# EAGLE design mainboard (EAGLE 9.1.3)
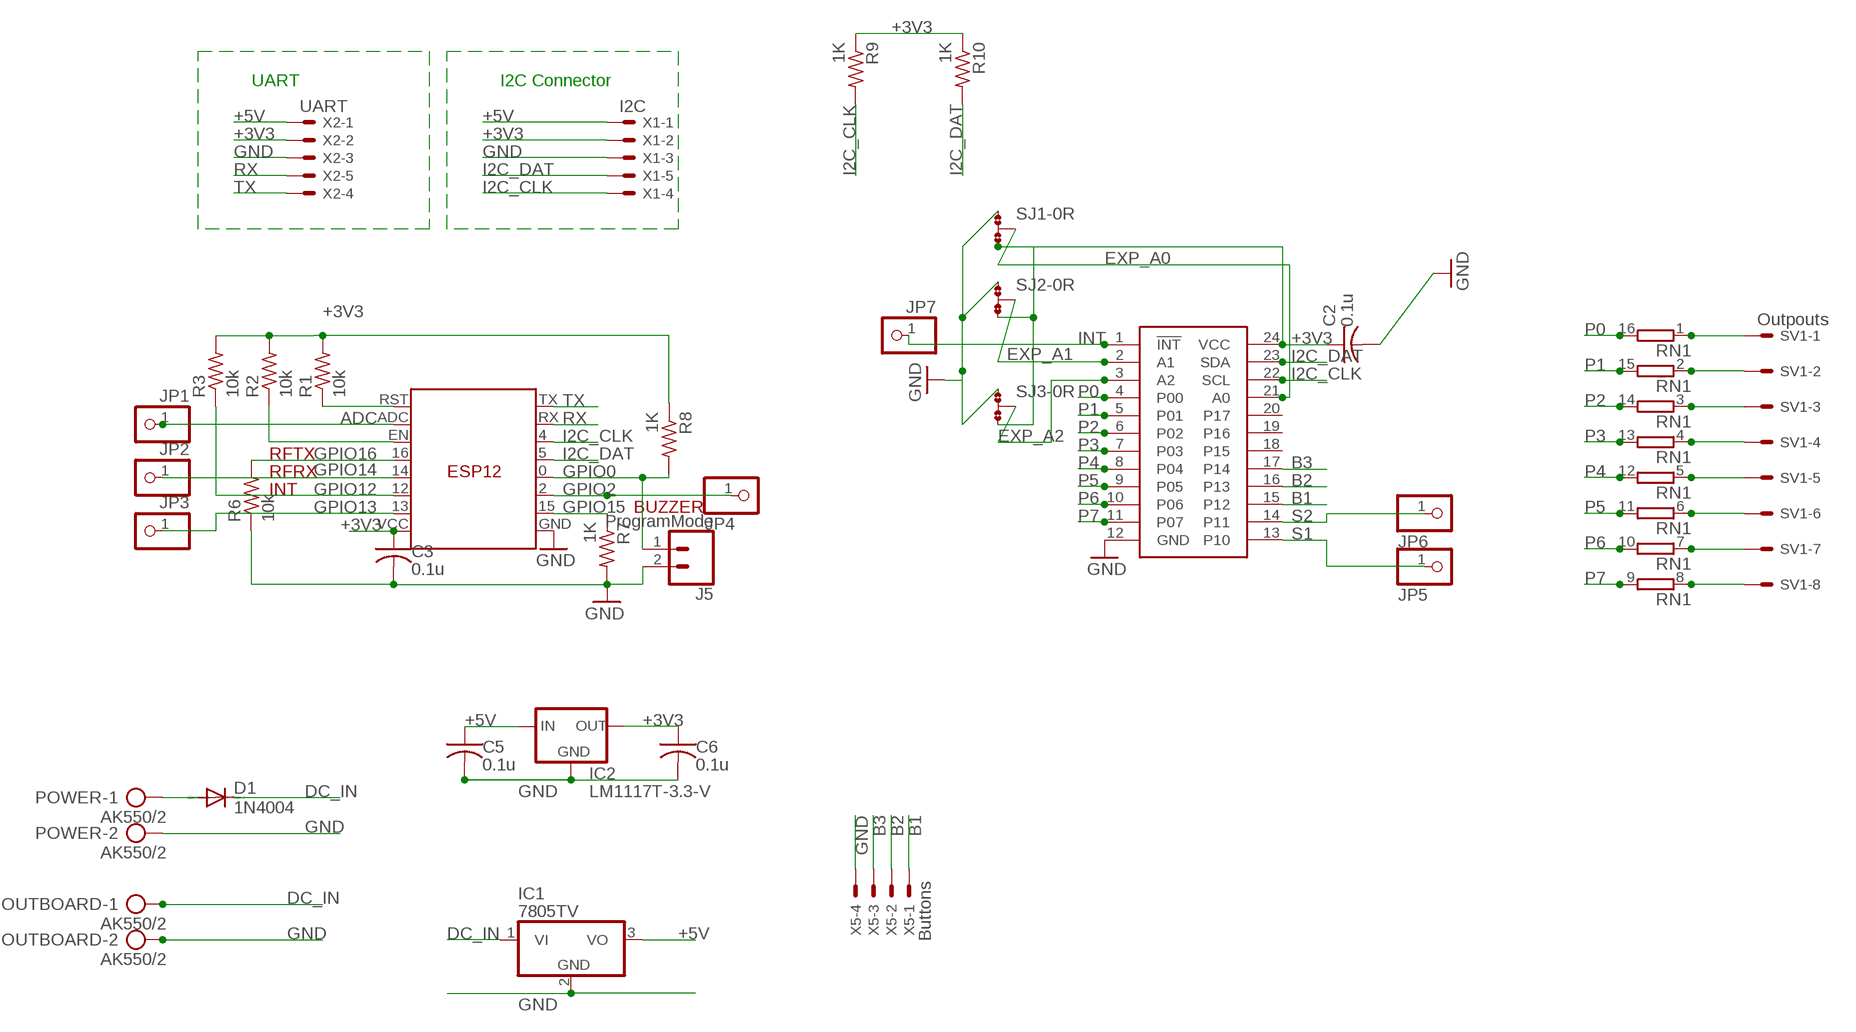
[diagram p0: schematic, sheet 1]

## Parts
C2  0.1u  C-US050-045X075  [C050-045X075]
C3  0.1u  C-US050-045X075  [C050-045X075]
C5  0.1u  C-US050-045X075  [C050-045X075]
C6  0.1u  C-US050-045X075  [C050-045X075]
D1  1N4004  [DO41-10]
ESP  ESP-12N  ESP12ESPWES  [ESP12_WES]
IC1  7805TV  [TO220V]
IC2  LM1117T-3.3-V  [TO220V]
J5  ProgramMode  CONN_02  [1X02]
JP1  PINHD-1X1  [1X01]
JP2  PINHD-1X1  [1X01]
JP3  PINHD-1X1  [1X01]
JP4  PINHD-1X1  [1X01]
JP5  PINHD-1X1  [1X01]
JP6  PINHD-1X1  [1X01]
JP7  PINHD-1X1  [1X01]
OUTBOARD  AK550/2  [AK550/2]
PCA9555  PCA9555  PCF8575TSSOP24  [TSSOP24]
POWER  AK550/2  [AK550/2]
R1  10k  R-US_0204/7  [0204/7]
R2  10k  R-US_0204/5  [0204/5]
R3  10k  R-US_0204/7  [0204/7]
R6  10k  R-US_0204/7  [0204/7]
R7  1K  R-US_0204/7  [0204/7]
R8  1K  R-US_0204/7  [0204/7]
R9  1K  R-US_0204/7  [0204/7]
R10  1K  R-US_0204/7  [0204/7]
RN1  8R-P  [DIL16]
SJ1  0R-JUMPA  [A0R-JMP]
SJ2  0R-JUMPA  [A0R-JMP]
SJ3  0R-JUMPA  [A0R-JMP]
SV1  Outpouts  22-23-2081  [22-23-2081]
X1  I2C  22-23-2051  [22-23-2051]
X2  UART  22-23-2051  [22-23-2051]
X5  Buttons  22-23-2041  [22-23-2041]

## Nets
+3V3 [power]: C2.1 C3.1 C6.1 ESP.VCC IC2.2(OUT) PCA9555.24(VCC) R1.2 R2.2 R3.2 R8.1 R9.1 R10.1 SJ1.3 SJ2.3 SJ3.3 X1.2 X2.2
+5V [power]: C5.1 IC1.3(VO) IC2.3(IN) X1.1 X2.1
ADC: ESP.ADC JP1.1
B1 [signal]: PCA9555.15(P12) X5.1
B2 [signal]: PCA9555.16(P13) X5.2
B3 [signal]: PCA9555.17(P14) X5.3
DC_IN [power]: D1.C IC1.1(VI) OUTBOARD.1
EXP_A0 [signal]: PCA9555.21(A0) SJ1.2
EXP_A1: PCA9555.2(A1) SJ2.2
EXP_A2: PCA9555.3(A2) SJ3.2
GND [power]: C2.2 C3.2 C5.2 C6.2 ESP.GND IC1.2(GND) IC2.1(GND) J5.2 OUTBOARD.2 PCA9555.12(GND) POWER.2 R6.1 R7.2 SJ1.1 SJ2.1 SJ3.1 X1.3 X2.3 X5.4
GPIO0: ESP.0(G0) J5.1 R8.2
GPIO2: ESP.2(G2) JP4.1
GPIO12: ESP.12(G12) R3.1
GPIO13: ESP.13(G13) JP3.1
GPIO14: ESP.14(G14) JP2.1
GPIO15: ESP.15(G15) R7.1
GPIO16: ESP.16(G16) R6.2
I2C_CLK: ESP.4(G4) PCA9555.22(SCL) R9.2 X1.4
I2C_DAT: ESP.5(G5) PCA9555.23(SDA) R10.2 X1.5
INT [signal]: JP7.1 PCA9555.1(!INT)
N$3 [power]: D1.A POWER.1
N$6: ESP.EN R2.1
N$7: RN1.1 SV1.1
N$8: RN1.2 SV1.2
N$9: RN1.3 SV1.3
N$10: RN1.4 SV1.4
N$12: RN1.5 SV1.5
N$13: RN1.6 SV1.6
N$14: RN1.7 SV1.7
N$16: RN1.8 SV1.8
N$19: ESP.RST R1.1
P0: PCA9555.4(P00) RN1.16
P1: PCA9555.5(P01) RN1.15
P2: PCA9555.6(P02) RN1.14
P3: PCA9555.7(P03) RN1.13
P4: PCA9555.8(P04) RN1.12
P5: PCA9555.9(P05) RN1.11
P6: PCA9555.10(P06) RN1.10
P7: PCA9555.11(P07) RN1.9
RX: ESP.RX X2.5
S1 [signal]: JP5.1 PCA9555.13(P10)
S2 [signal]: JP6.1 PCA9555.14(P11)
TX: ESP.TX X2.4
Unconnected: PCA9555.18(P15) PCA9555.19(P16) PCA9555.20(P17)

## Notes on the sheet
- UART | I2C Connector
- RFTX
- RFRX
- INT
- BUZZER

## Library data of the parts
C2 C3 C5 C6 = resistor:C-US: CAPACITOR, American symbol
D1 = diode:1N4004: DIODE general purpose rectifier, 1 A
ESP = JeeParts:ESP12
IC1 = linear:78*: Positive VOLTAGE REGULATOR Source: http://cache.national.com/ds/LM/LM78L05.pdf http://www.fairchildsemi.com/ds/LM/LM7805.pdf
IC2 = lm1117:LM1117T-*
J5 = SparkFun-Connectors:CONN_02: Multi connection point. Often used as Generic Header-pin footprint for 0.1 inch spaced/style header connections On any of the 0.1 inch spaced packages, you can populate with these: Break Away Headers - Straight <https://www.sparkfun.com/products/116> (PRT-00116) Break Away Male Headers - Right Angle <https://www.sparkfun.com/products/553> (PRT-00553) Female Headers <https://www.sparkfun.com/products/115> (PRT-00115) Break Away Headers - Machine Pin <https://www.sparkfun.com/products/117> (PRT-00117) Break Away Female Headers - Swiss Machine Pin <https://www.sparkfun.com/products/743> (PRT-00743) For SCREWTERMINALS and SPRING TERMINALS visit here: Screw Terimnals on SparkFun.com <https://www.sparkfun.com/search/results?term=Screw+Terminals> (5mm/3.5mm/2.54mm spacing) This device is also useful as a general connection point to wire up your design to another part of your project. Our various solder wires solder well into these plated through hole pads. Hook-Up Wire - Assortment (Stranded, 22 AWG) <https://www.sparkfun.com/products/11375> (PRT-11375) Hook-Up Wire - Assortment (Solid Core, 22 AWG) <https://www.sparkfun.com/products/11367> (PRT-11367) View the entire wire category on our website here <https://www.sparkfun.com/categories/141> Special notes: Molex polarized connector foot print use with: PRT-08233 with associated crimp pins and housings. 2.54_SCREWTERM for use with PRT-10571. 3.5mm Screw Terminal footprints for PRT-08084 5mm Screw Terminal footprints for use with PRT-08432
JP1-JP7 = pinhead:PINHD-1X1: PIN HEADER
OUTBOARD POWER = con-ptr500:AK550/2: CONNECTOR; OC_FARNELL: unknown; OC_NEWARK: unknown
PCA9555 = SparkFunNew:PCF8575
R1-R3 R6-R10 = resistor:R-US_: RESISTOR, American symbol
RN1 = resistor-dil:8R-P: DIL RESISTOR; OC_FARNELL: unknown; OC_NEWARK: unknown
SJ1-SJ3 = jump-0r-smd:0R-JUMP: SMD 0R 0805 Jumper
SV1 = con-molex:22-23-2081: .100" (2.54mm) Center Header - 8 Pin; MF: MOLEX; MPN: 22-23-2081; OC_FARNELL: 1756826; OC_NEWARK: 01C7592
X1 X2 = con-molex:22-23-2051: .100" (2.54mm) Center Header - 5 Pin; MF: MOLEX; MPN: 22-23-2051; OC_FARNELL: 1462952; OC_NEWARK: 38C9178
X5 = con-molex:22-23-2041: .100" (2.54mm) Center Header - 4 Pin; MF: MOLEX; MPN: 22-23-2041; OC_FARNELL: 1462920; OC_NEWARK: 38C0355

## Net classes
0 default: width 0.406 mm
1 power: width 0.406 mm, drill 0.508 mm, clearance 0.203 mm
3 signal: width 0.406 mm, clearance 0.178 mm
4 adc: width 0.406 mm, clearance 0.178 mm

## Board
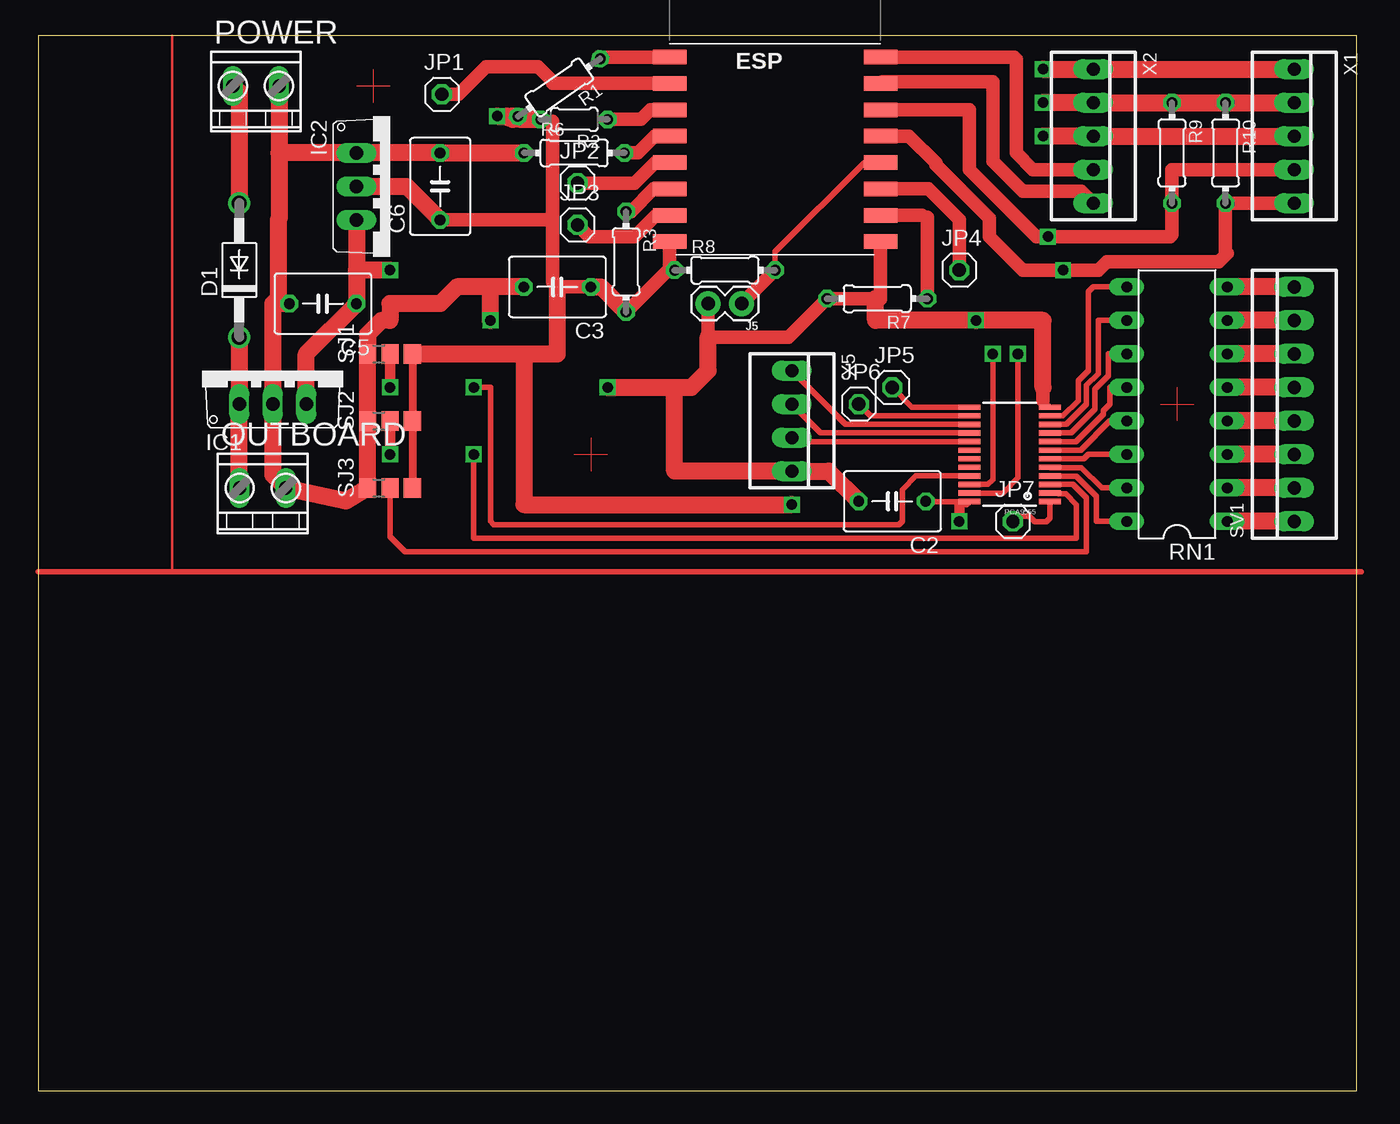
[diagram p1: board, top side]
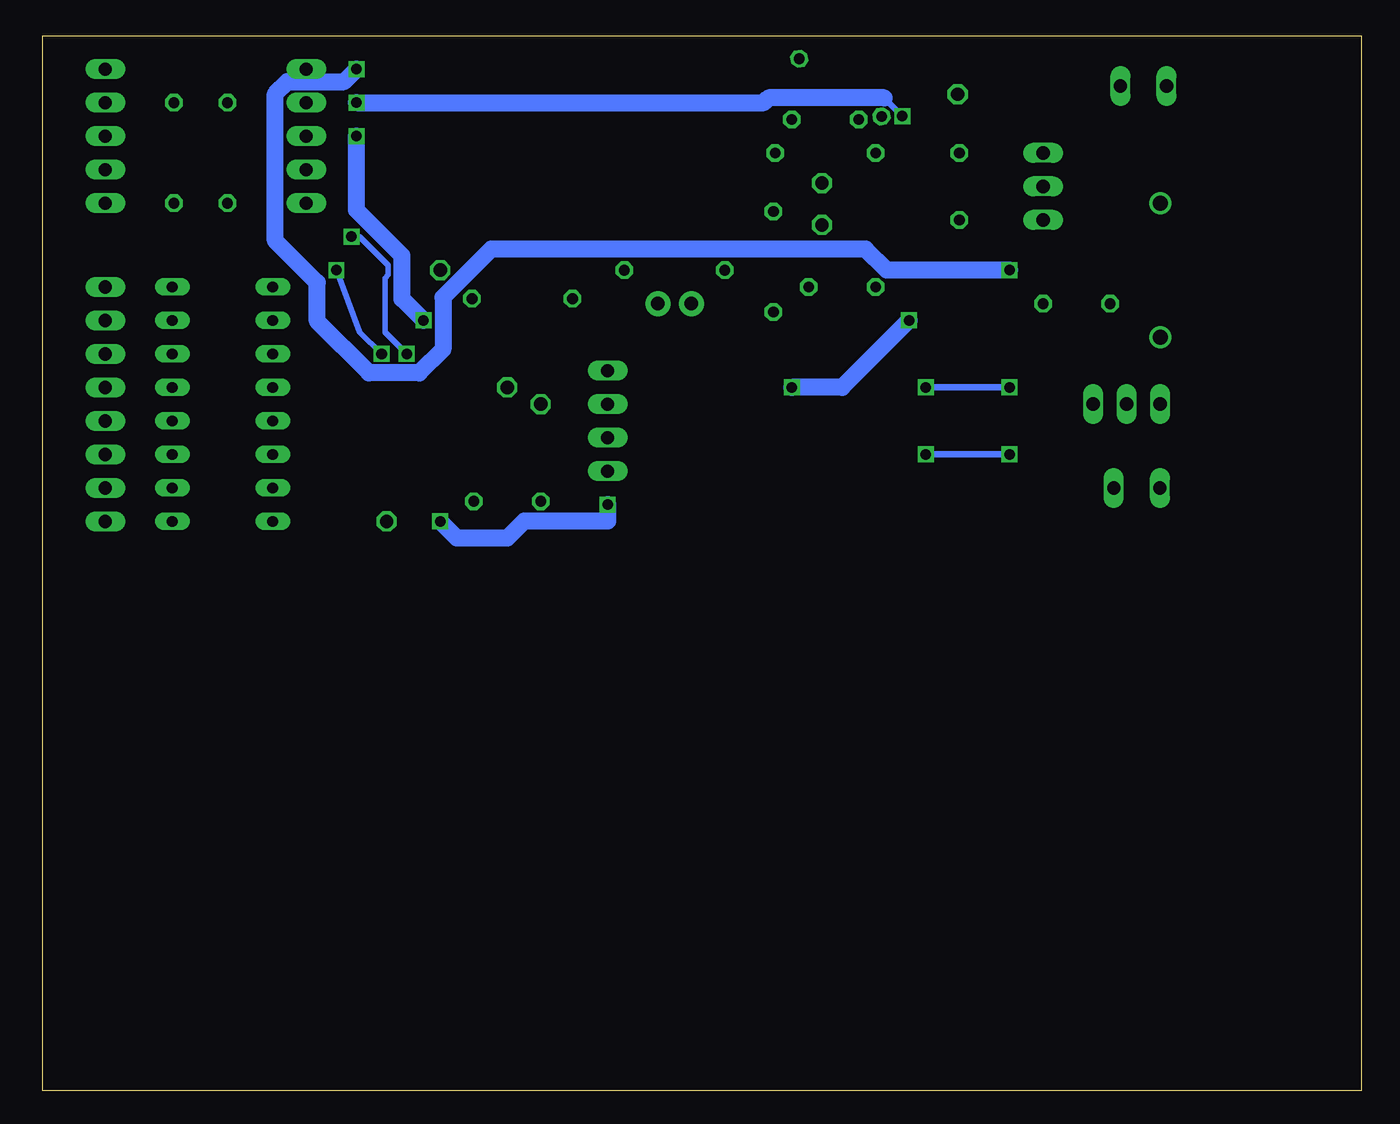
[diagram p2: board, bottom side, seen from below]

Size 100 x 80 mm. Coordinates in mm from the lower left corner, seen from the top.
Outline: 0,0 100,0 100,80 0,80 0,0
Copper layers (1*16): Top 0.035mm / dielectric 1.5mm / Bottom 0.035mm
Design rules "default": minimum track width 6mil, minimum drill 0.35mm, track to track 6mil, track to pad 6mil, pad to pad 6mil, via to via 6mil, smd to smd 6mil, copper to edge 40mil, drill to drill 6mil, minimum pad ring 10mil, minimum via ring 8mil, stop-mask expansion 4mil, vias tented up to drill 0mil, thermal gap 10mil

### Footprints (pad centres in the part's own frame; a part is rotated, then mirrored left to right if it is on the bottom)
C050-045X075 = drill 0.813 octagon: 1 -2.54,0; 2 2.54,0
DO41-10 = drill 1.118: A 5.08,0; C -5.08,0
ESP12_WES = smd 2.54 x 1.1: 0 8,-3.27; 2 8,-5.27; 4 8,0.73; 5 8,-1.27; 12 -8,-5.27; 13 -8,-7.27; 14 -8,-3.27; 15 8,-7.27; 16 -8,-1.27; ADC -8,2.73; EN -8,0.73; GND 8,-9.27; RST -8,4.73; RX 8,2.73; TX 8,4.73; VCC -8,-9.27
TO220V = drill 1.016 long: 1 -2.54,-2.54; 2 0,-2.54; 3 2.54,-2.54
1X02 = drill 1.016 pad 1.88: 1 0,0; 2 2.54,0
1X01 = drill 1.016 octagon: 1 0,0
AK550/2 = drill 1 pad 1.5 long: 1 -1.75,0; 2 1.75,0
TSSOP24 = smd 0.4 x 1.65: 1 -3.575,-3.05; 2 -2.925,-3.05; 3 -2.275,-3.05; 4 -1.625,-3.05; 5 -0.975,-3.05; 6 -0.325,-3.05; 7 0.325,-3.05; 8 0.975,-3.05; 9 1.625,-3.05; 10 2.275,-3.05; 11 2.925,-3.05; 12 3.575,-3.05; 13 3.575,3.05; 14 2.925,3.05; 15 2.275,3.05; 16 1.625,3.05; 17 0.975,3.05; 18 0.325,3.05; 19 -0.325,3.05; 20 -0.975,3.05; 21 -1.625,3.05; 22 -2.275,3.05; 23 -2.925,3.05; 24 -3.575,3.05
0204/7 = drill 0.813 octagon: 1 -3.81,0; 2 3.81,0
0204/5 = drill 0.813 octagon: 1 -2.54,0; 2 2.54,0
DIL16 = drill 0.813 long: 1 -8.89,-3.81; 2 -6.35,-3.81; 3 -3.81,-3.81; 4 -1.27,-3.81; 5 1.27,-3.81; 6 3.81,-3.81; 7 6.35,-3.81; 8 8.89,-3.81; 9 8.89,3.81; 10 6.35,3.81; 11 3.81,3.81; 12 1.27,3.81; 13 -1.27,3.81; 14 -3.81,3.81; 15 -6.35,3.81; 16 -8.89,3.81
A0R-JMP = smd 1.5 x 1.3: 1 0,1.7; 2 0,0; 3 0,-1.7
22-23-2081 = drill 1 long: 1 -8.89,0; 2 -6.35,0; 3 -3.81,0; 4 -1.27,0; 5 1.27,0; 6 3.81,0; 7 6.35,0; 8 8.89,0
22-23-2051 = drill 1 long: 1 -5.08,0; 2 -2.54,0; 3 0,0; 4 2.54,0; 5 5.08,0
22-23-2041 = drill 1 long: 1 -3.81,0; 2 -1.27,0; 3 1.27,0; 4 3.81,0

### Placement (x,y rotation side)
C2  64.77,44.7 180 top
C3  39.37,60.96 180 top
C5  21.59,59.69 180 top
C6  30.48,68.58 90 top
D1  15.24,62.23 90 top
ESP  55.88,73.66 0 top
IC1  17.78,54.61 0 top
IC2  26.67,68.58 270 top
J5  53.34,59.69 180 top
JP1  30.61,75.56 0 top
JP2  40.89,68.83 0 top
JP3  40.89,65.66 0 top
JP4  69.85,62.23 0 top
JP5  64.77,53.34 0 top
JP6  62.23,52.07 0 top
JP7  73.91,43.18 0 top
OUTBOARD  17.02,45.72 0 top
PCA9555  73.66,48.26 90 top
POWER  16.51,76.2 0 top
R1  39.5,76.07 215 top
R2  40.64,73.66 180 top
R3  44.58,62.87 270 top
R6  40.64,71.12 0 top
R7  63.63,60.07 180 top
R8  52.07,62.23 0 top
R9  85.98,71.12 270 top
R10  90.04,71.12 270 top
RN1  86.36,52.07 90 top
SJ1  26.67,55.88 90 top
SJ2  26.67,50.8 90 top
SJ3  26.67,45.72 90 top
SV1  95.25,52.07 90 top
X1  95.25,72.39 270 top
X2  80.01,72.39 270 top
X5  57.15,50.8 270 top

### Tracks (layer width: path | path; a pad name or v marks a point on that pad's centre or on a via)
+3V3  (via drill 0.8)
  Top 0.406: C2.1 67.33,44.69 PCA9555.24 70.38,44.45 69.85,44.45
  Top 0.61: SJ1.3 SJ2.3 SJ3.3 | R2.2 36.96,73.53 38.99,73.53 | 38.99,61.34 39.37,60.96
  Top 0.813: 69.85,44.45 v69.85,43.18
  Top 1.016: ESP.VCC 47.88,62.61 R8.1 47.75,62.23 R3.2 | 38.99,73.53 38.99,66.04 | 38.99,66.04 38.99,61.34 | 39.37,60.96 C3.1 | C6.1 38.99,66.04
  Top 1.27: C3.1 42.67,60.96 R3.2 | X1.2 R9.1 R10.1 X2.2 v76.2,74.93 | SJ1.3 36.83,55.88 | 36.83,55.88 39.37,55.88 39.37,60.96 | 36.83,55.88 36.83,44.45 v57.15,44.45 | 35.79,73.89 R1.2 36.6,73.66 R2.2 35.98,73.66 35.7,73.77 35.53,73.91 v34.8,73.91 | IC2.2 27.94,68.58 C6.1
  Bottom 0.406: v34.8,73.91 36.16,75.28 36.16,75.29
  Bottom 1.27: v76.2,74.93 45.3,74.93 44.94,75.29 36.16,75.29 | v57.15,44.45 57.15,43.2 63.48,43.2 64.77,41.91 68.58,41.91 v69.85,43.18
+5V  (via drill 0.8)
  Top 1.27: X1.1 X2.1 v76.2,77.47 | IC1.3 20.32,55.88 C5.1 24.13,62.23 | IC2.3 24.13,62.23 | v26.67,62.23 24.13,62.23
  Bottom 1.27: v26.67,62.23 35.98,62.23 37.58,63.83 65.99,63.83 69.65,60.17 69.65,56.23 71.44,54.44 75.25,54.44 79.17,58.36 79.17,61.28 82.36,64.47 82.36,75.59 81.42,76.52 77.15,76.52 v76.2,77.47
ADC
  Top 1.016: JP1.1 31.88,75.56 33.97,77.66 37.91,77.66 39.09,76.48 38.99,76.39 ESP.ADC
B1
  Top 0.406: PCA9555.15 61.23,50.53 X5.1
B2
  Top 0.406: PCA9555.16 59.34,49.88 X5.2
B3
  Top 0.406: PCA9555.17 57.45,49.23 X5.3
DC_IN
  Top 1.27: D1.C IC1.1 15.24,45.75 OUTBOARD.1
EXP_A0  (via drill 0.8)
  Top 0.406: v33.02,53.34 34.29,53.34 34.29,43.18 34.54,42.93 59.69,42.93 59.82,42.93 65.28,42.93 65.53,43.18 65.53,45.59 66.57,46.63 PCA9555.21
  Top 0.813: SJ1.2 v26.67,53.34
  Bottom 0.508: v26.67,53.34 v33.02,53.34
EXP_A1  (via drill 0.8)
  Top 0.406: v33.02,48.26 33.02,41.91 78.74,41.91 78.74,44.45 77.92,45.27 77.42,45.27 77.35,45.34 | 77.35,45.34 77.34,45.34 | PCA9555.2 77.35,45.34
  Top 0.813: SJ2.2 v26.67,48.26
  Bottom 0.508: v33.02,48.26 v26.67,48.26
EXP_A2
  Top 0.406: PCA9555.3 78.47,45.98 79.5,44.96 79.5,40.89 27.81,40.89 26.67,42.04 SJ3.2
GND  (via drill 0.8)
  Top 0.406: PCA9555.12 76.2,52.34
  Top 1.016: ESP.GND 63.88,60.02 63.86,60.07 63.5,60.07 R7.2 56.9,57.15 50.8,57.15 J5.2 | 76.2,52.34 76.2,53.34
  Top 1.27: 17.78,59.69 IC1.2 17.78,46.71 OUTBOARD.2 23.33,44.73 SJ3.1 SJ2.1 SJ1.1 24.97,57.35 26.04,58.42 26.67,58.42 26.67,59.69 30.48,59.69 31.75,60.96 34.29,60.96 | X1.3 X2.3 v76.2,72.39 | v43.18,53.34 48.26,53.34 | 48.26,53.34 49.53,53.34 50.8,54.61 50.8,57.15 | 76.2,53.34 76.2,58.42 v71.12,58.42 63.5,58.42 63.5,60.07 | 48.26,53.34 48.26,46.99 X5.4 59.94,46.99 C2.2 | POWER.2 18.26,71.12 | 18.26,71.12 18.26,66.1 18.2,66.04 18.2,60.11 17.78,59.69 | C5.2 17.78,59.69 | 18.26,71.12 IC2.1 C6.2 R6.1 | C3.2 34.29,60.96 | v34.29,58.42 34.29,60.96
  Bottom 1.27: v34.29,58.42 39.37,53.34 v43.18,53.34 | v76.2,72.39 76.2,66.78 72.75,63.33 72.75,60.05 v71.12,58.42
GPIO0
  Top 0.406: ESP.0 62.64,70.39 55.88,63.63 R8.2
  Top 1.016: J5.1 R8.2
GPIO2
  Top 1.016: ESP.2 67.5,68.39 69.85,66.04 JP4.1
GPIO12
  Top 1.016: ESP.12 46.67,68.39 44.96,66.67 R3.1
GPIO13
  Top 1.016: ESP.13 46.83,66.39 45.21,64.77 41.78,64.77 JP3.1
GPIO14
  Top 1.016: ESP.14 46.77,70.39 45.97,69.6 45.21,68.83 JP2.1
GPIO15
  Top 1.016: ESP.15 67.01,66.39 67.44,66.25 R7.1
GPIO16
  Top 1.016: R6.2 45.47,71.12 46.74,72.39 ESP.16
I2C_CLK  (via drill 0.8)
  Top 0.406: PCA9555.22 72.02,45.98 72.39,46.35 v72.39,55.88
  Top 1.016: ESP.4 70.61,74.39 70.61,69.85 73.94,66.52 75.69,64.77 v76.58,64.77 85.85,64.77 85.98,64.9 R9.2 85.98,69.85 X1.4
  Bottom 0.406: v72.39,55.88 74.04,57.53 74.04,61.62 73.79,61.86 73.79,62.6 75.97,64.77 v76.58,64.77
I2C_DAT  (via drill 0.8)
  Top 0.406: PCA9555.23 73.15,45.34 74.3,46.48 v74.3,55.88
  Top 1.016: ESP.5 66.04,72.39 68.07,70.36 68.07,70.23 72.14,66.17 72.14,64.77 74.68,62.23 v77.72,62.23 80.39,62.23 81.03,62.87 89.53,62.87 90.17,63.5 90.04,63.63 R10.2 X1.5
  Bottom 0.406: v77.72,62.23 75.95,57.53 v74.3,55.88
INT
  Top 0.406: PCA9555.1 76.71,43.41 76.45,43.16 75.59,43.16 75.18,43.56 74.3,43.56 JP7.1
N$1
  Top 0.203: 10.16,39.37 10.16,80.01
  Top 0.406: 0,39.37 10.16,39.37 100.33,39.37
N$2
  Top 0.076: 86.36,53.34 86.36,50.8
N$3
  Top 1.27: D1.A 15.24,75.72 POWER.1
N$4
  Top 0.076: 85.09,52.07 87.63,52.07
N$5
  Top 0.076: 41.91,49.53 41.91,46.99
N$6
  Top 1.016: ESP.EN 46.45,74.39 45.72,73.66 R2.1
N$7
  Top 1.27: SV1.1 RN1.1
N$8
  Top 1.27: SV1.2 RN1.2
N$9
  Top 1.27: SV1.3 RN1.3
N$10
  Top 1.27: SV1.4 RN1.4
N$11
  Top 0.076: 40.64,48.26 43.18,48.26
N$12
  Top 1.27: SV1.5 RN1.5
N$13
  Top 1.27: SV1.6 RN1.6
N$14
  Top 1.27: SV1.7 RN1.7
N$15
  Top 0.076: 25.4,77.47 25.4,74.93
N$16
  Top 1.27: SV1.8 RN1.8
N$17
  Top 0.076: 24.13,76.2 26.67,76.2
N$19
  Top 1.016: ESP.RST 42.48,78.39 R1.1
P0
  Top 0.406: PCA9555.4 76.74,46.61 78.74,46.61 80.26,45.09 80.26,43.18 RN1.16
P1
  Top 0.406: PCA9555.5 76.75,47.24 79.12,47.24 80.64,45.72 RN1.15
P2
  Top 0.406: PCA9555.6 79.3,47.94 79.63,48.26 RN1.14
P3
  Top 0.406: PCA9555.7 79.06,48.59 81.28,50.8 RN1.13
P4
  Top 0.406: RN1.12 81.28,53.34 81.28,52.07 80.77,51.56 80.77,51.31 78.7,49.23 PCA9555.8
P5
  Top 0.406: PCA9555.9 78.33,49.88 80.14,51.69 80.14,53.21 81.15,54.23 81.15,55.88 RN1.11
P6
  Top 0.406: PCA9555.10 77.97,50.53 79.5,52.07 79.5,53.49 80.39,54.38 80.39,58.42 RN1.10
P7
  Top 0.406: PCA9555.11 77.72,51.19 77.72,51.18 78.87,52.32 78.87,53.85 79.63,54.61 79.63,60.58 80.01,60.96 RN1.9
RX
  Top 1.016: X2.5 79.12,68.2 74.68,68.2 72.39,70.48 72.39,76.52 64.01,76.52 ESP.RX
S1
  Top 0.406: JP5.1 66.28,51.84 PCA9555.13
S2
  Top 0.406: JP6.1 63.12,51.19 PCA9555.14
TX
  Top 1.016: X2.4 75.44,69.85 74.17,71.12 74.17,78.23 74.01,78.39 ESP.TX